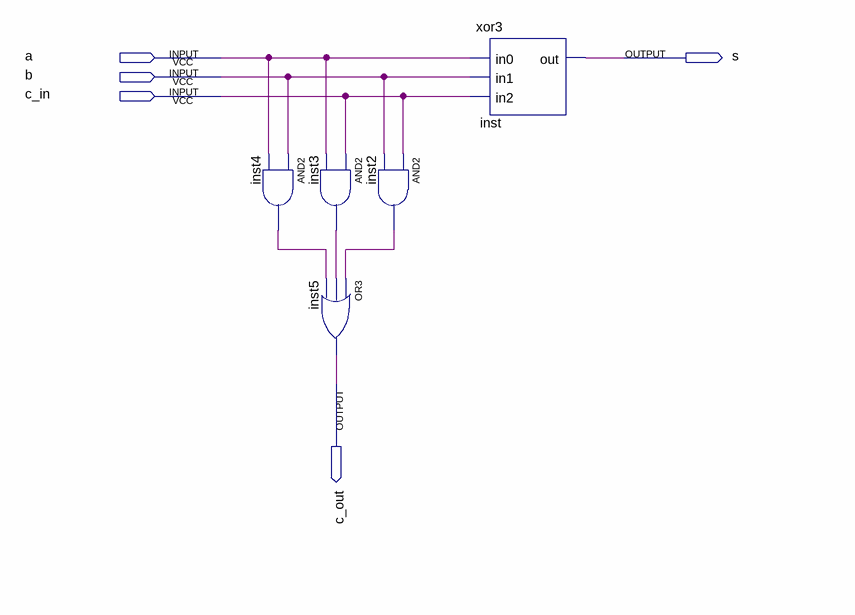
[diagram p0: schematic sheet]
// Quartus schematic full_adder.bdf as structural Verilog: 5 symbols, 5 pins
module full_adder (
  input  a,
  input  b,
  input  c_in,
  output s,
  output c_out
);

  wire inst2_out, inst3_out, inst4_out;

  and inst4 (inst4_out, b, a);
  and inst3 (inst3_out, c_in, a);
  or inst5 (c_out, inst2_out, inst3_out, inst4_out);
  and inst2 (inst2_out, c_in, b);
  xor3 inst (.in0(a), .in1(b), .in2(c_in), .out(s));
endmodule
